# Altium schematic sheet Mini-DSO-WaveGen-in-one.SchDoc
size A4; SheetNumber: 1; SheetTotal: 7
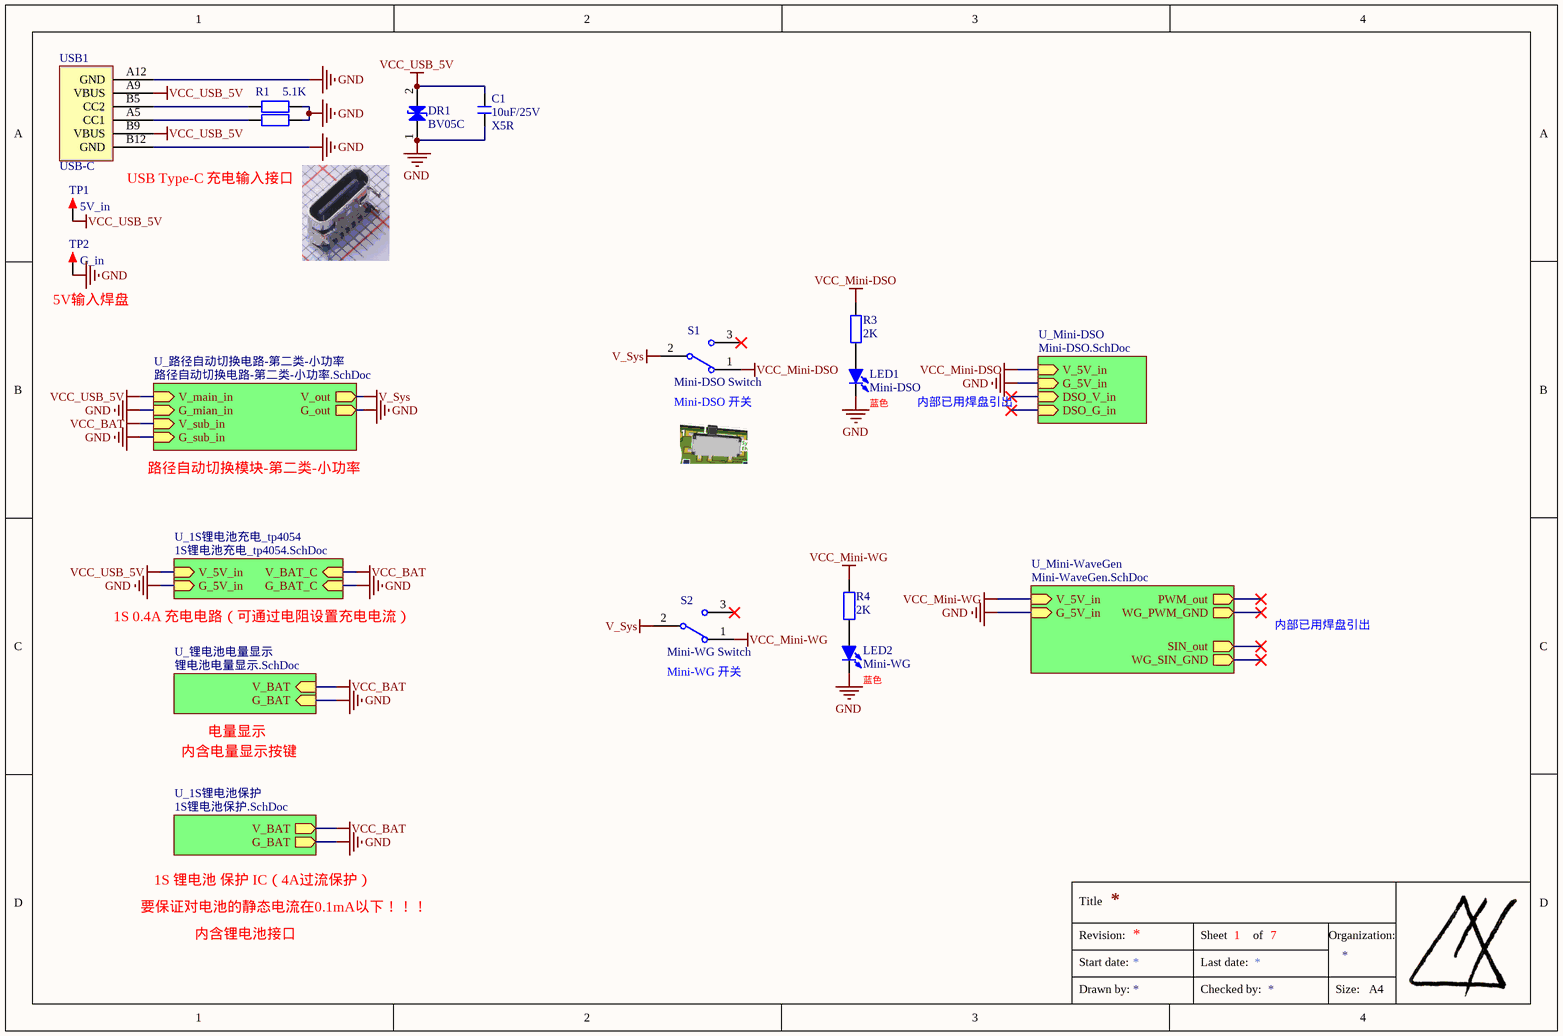
[diagram p0: Mini-DSO-WaveGen-in-one.SchDoc]

## Parts
C1  10uF/25V  BOM名称: X5R  [C 0603_L]
DR1  BV05C  [SOD-323]
LED1  Mini-DSO  [LED 0805R]
LED2  Mini-WG  [LED 0805R]
R1  5.1K  [R 0402_L]
R2  5.1K  [R 0402_L]  (value not drawn)
R3  2K  [R 0402_L]
R4  2K  [R 0402_L]
S1  Mini-DSO Switch  [MSK-12C01-07]
S2  Mini-WG Switch  [MSK-12C01-07]
TP1  5V_in  [TEST 1.6]
TP2  G_in  [TEST 1.6]
USB1  USB-C  [USB-C/S_C]

## Sub-sheets
U_1S锂电池保护 = 1S锂电池保护.SchDoc: V_BAT (out), G_BAT (out)
U_1S锂电池充电_tp4054 = 1S锂电池充电_tp4054.SchDoc: V_5V_in (in), G_5V_in (in), V_BAT_C (in), G_BAT_C (in)
U_Mini-DSO = Mini-DSO.SchDoc: V_5V_in (in), G_5V_in (in), DSO_V_in (in), DSO_G_in (in)
U_Mini-WaveGen = Mini-WaveGen.SchDoc: V_5V_in (in), G_5V_in (in), PWM_out (out), SIN_out (out), WG_PWM_GND (out), WG_SIN_GND (out)
U_路径自动切换电路-第二类-小功率 = 路径自动切换电路-第二类-小功率.SchDoc: V_main_in (in), G_mian_in (in), V_out (out), G_out (out), V_sub_in (in), G_sub_in (in)
U_锂电池电量显示 = 锂电池电量显示.SchDoc: V_BAT (in), G_BAT (in)

## Nets
GND: C1.1 DR1.1(A) LED1.2(K) LED2.2(K) R1.1 R2.1 TP2.1 USB1.A12(GND) USB1.B12(GND) ; sheet U_1S锂电池保护/G_BAT, sheet U_锂电池电量显示/G_BAT, sheet U_1S锂电池充电_tp4054/G_5V_in, sheet U_1S锂电池充电_tp4054/G_BAT_C, sheet U_路径自动切换电路-第二类-小功率/G_mian_in, sheet U_路径自动切换电路-第二类-小功率/G_out, sheet U_路径自动切换电路-第二类-小功率/G_sub_in, sheet U_Mini-WaveGen/G_5V_in, sheet U_Mini-DSO/G_5V_in
V_Sys: S1.2 S2.2 ; sheet U_路径自动切换电路-第二类-小功率/V_out
VCC_BAT: sheet U_1S锂电池保护/V_BAT, sheet U_锂电池电量显示/V_BAT, sheet U_1S锂电池充电_tp4054/V_BAT_C, sheet U_路径自动切换电路-第二类-小功率/V_sub_in
VCC_Mini-DSO: R3.1 S1.1 ; sheet U_Mini-DSO/V_5V_in
VCC_Mini-WG: R4.1 S2.1 ; sheet U_Mini-WaveGen/V_5V_in
VCC_USB_5V: C1.2 DR1.2(K) TP1.1 USB1.A9(VBUS) USB1.B9(VBUS) ; sheet U_1S锂电池充电_tp4054/V_5V_in, sheet U_路径自动切换电路-第二类-小功率/V_main_in
NetLED1_1: LED1.1(A) R3.2
NetLED2_1: LED2.1(A) R4.2
NetR1_2: R1.2 USB1.B5(CC2)
NetR2_2: R2.2 USB1.A5(CC1)

Not connected (* = marked no-connect by the designer): S1 3*; S2 3*

## Notes on the sheet
- (near USB1) USB Type-C 充电输入接口
- (near TP2) 5V输入焊盘
- (near S1) Mini-DSO 开关
- (near LED1) 蓝色
- 内部已用焊盘引出
- 路径自动切换模块-第二类-小功率
- 1S 0.4A 充电电路（可通过电阻设置充电电流）
- (near S2) Mini-WG 开关
- (near LED2) 蓝色
- 内含电量显示按键
- 电量显示
- 要保证对电池的静态电流在0.1mA以下！！！
- 1S 锂电池 保护 IC（4A过流保护）
- 内含锂电池接口
- Title
- Start date:
- Revision:
- Sheet
- Last date:
- of
- Organization:
- Drawn by:
- Checked by:
- Size:
- A4

## Library data of the parts
C1 = C X5R: 无极性贴片电容 X5R
DR1 = DR: 瞬态电压抑制二极管; 版权归属: 源创客; BOM名称: 瞬态电压抑制二极管; 学习资源: www.ooocke.com
LED1 = LED-SMD: 蓝色 贴片LED; 版权归属: 源创客; BOM名称: 蓝色 贴片LED; 学习资源: www.ooocke.com
LED2 = LED-SMD: 贴片LED 蓝色; BOM名称: 蓝色 贴片LED; 版权归属: 源创客; 学习资源: www.ooocke.com
R1-R4 = R: 贴片电阻 E-96 1%; BOM名称: E-96 1%
S1 S2 = SSW-1P: 1路拨动开关; pin to pad: 1>3 3>1; BOM名称: 拨动开关; 版权归属: 源创客; 学习资源: www.ooocke.com
TP1 TP2 = TEST: 测试点; 版权归属: 源创客; BOM名称: 测试点; 学习资源: www.ooocke.com
USB1 = USB-C_6P/S: USB-C_6P型母接口; BOM名称: USB-C型母接口; 版权归属: 源创客; 学习资源: www.ooocke.com